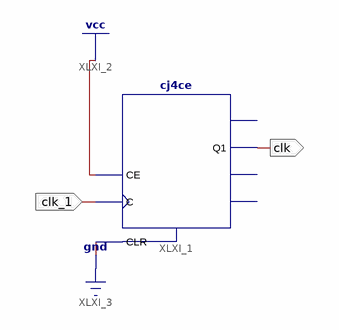
[diagram p0: schematic sheet 1]
// Xilinx ISE schematic clk_change.sch (spartan3e) as structural Verilog: 1 symbols, 2 ports
module clk_change (
  input  clk_1,
  output clk
);

  cj4ce XLXI_1 (.C(clk_1), .CE(1'b1), .CLR(1'b0), .Q1(clk));  // open: Q0, Q2, Q3
endmodule
